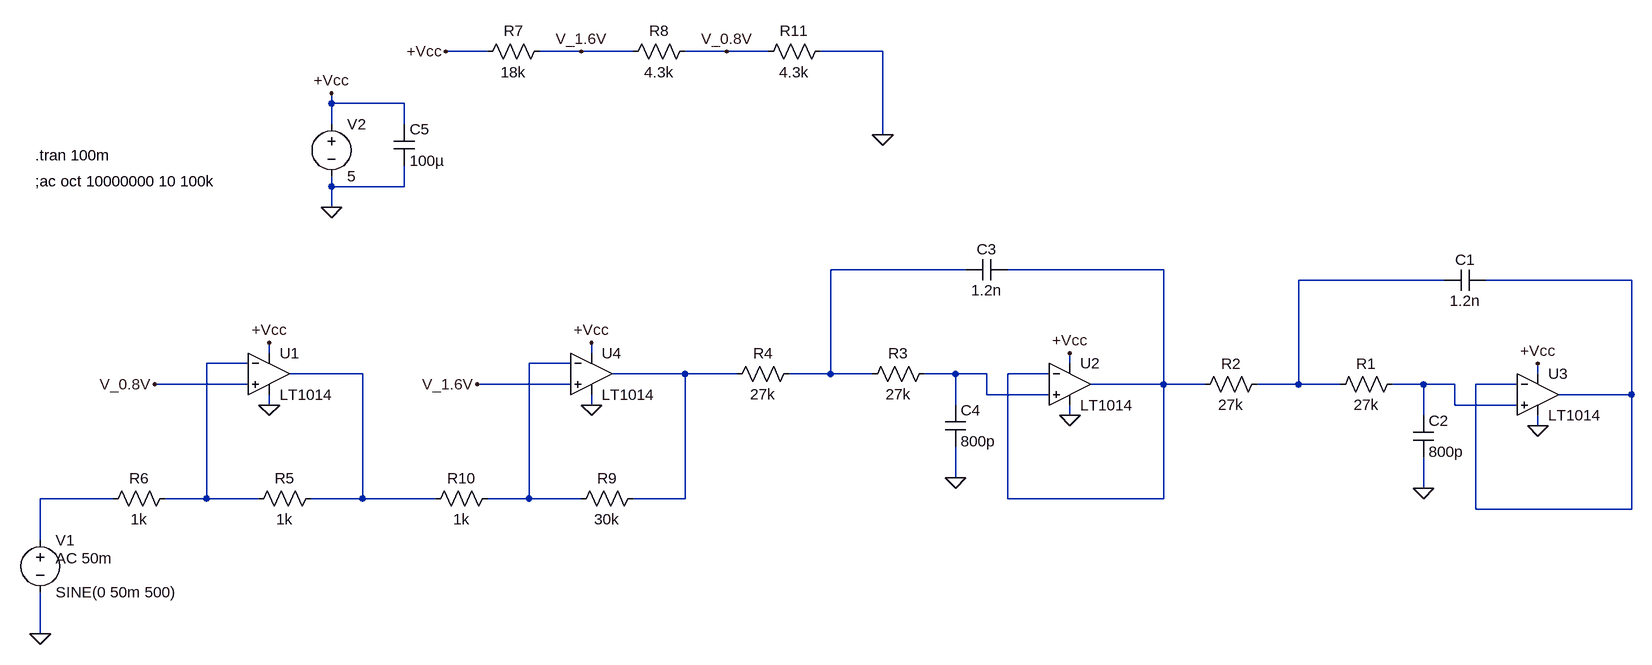
[diagram p0: schematic Lab_PCB.asc]
Lab_PCB.asc, the LTspice schematic file:
Version 4
SHEET 1 2728 680
WIRE 128 -864 64 -864
WIRE 272 -864 208 -864
WIRE 352 -864 272 -864
WIRE 496 -864 432 -864
WIRE 560 -864 496 -864
WIRE 736 -864 640 -864
WIRE -112 -784 -112 -800
WIRE 0 -784 -112 -784
WIRE -112 -752 -112 -784
WIRE 0 -752 0 -784
WIRE 736 -736 736 -864
WIRE -112 -656 -112 -672
WIRE 0 -656 0 -688
WIRE 0 -656 -112 -656
WIRE -112 -624 -112 -656
WIRE 864 -528 656 -528
WIRE 1168 -528 928 -528
WIRE 1600 -512 1376 -512
WIRE 1888 -512 1664 -512
WIRE -208 -400 -208 -416
WIRE 288 -400 288 -416
WIRE -240 -384 -304 -384
WIRE 256 -384 192 -384
WIRE 1024 -384 1024 -400
WIRE -64 -368 -176 -368
WIRE 432 -368 320 -368
WIRE 512 -368 432 -368
WIRE 656 -368 656 -528
WIRE 656 -368 592 -368
WIRE 720 -368 656 -368
WIRE 848 -368 800 -368
WIRE 896 -368 848 -368
WIRE 992 -368 928 -368
WIRE 1744 -368 1744 -384
WIRE -240 -352 -384 -352
WIRE 256 -352 112 -352
WIRE 1168 -352 1168 -528
WIRE 1168 -352 1056 -352
WIRE 1232 -352 1168 -352
WIRE 1376 -352 1376 -512
WIRE 1376 -352 1312 -352
WIRE 1440 -352 1376 -352
WIRE 1568 -352 1520 -352
WIRE 1616 -352 1568 -352
WIRE 1712 -352 1648 -352
WIRE 896 -336 896 -368
WIRE 992 -336 896 -336
WIRE 1888 -336 1888 -512
WIRE 1888 -336 1776 -336
WIRE -208 -320 -208 -336
WIRE 288 -320 288 -336
WIRE 848 -320 848 -368
WIRE 1616 -320 1616 -352
WIRE 1712 -320 1616 -320
WIRE 1024 -304 1024 -320
WIRE 1568 -304 1568 -352
WIRE 1744 -288 1744 -304
WIRE 848 -208 848 -256
WIRE 1568 -192 1568 -240
WIRE -448 -176 -560 -176
WIRE -304 -176 -304 -384
WIRE -304 -176 -368 -176
WIRE -224 -176 -304 -176
WIRE -64 -176 -64 -368
WIRE -64 -176 -144 -176
WIRE 48 -176 -64 -176
WIRE 192 -176 192 -384
WIRE 192 -176 128 -176
WIRE 272 -176 192 -176
WIRE 432 -176 432 -368
WIRE 432 -176 352 -176
WIRE 928 -176 928 -368
WIRE 1168 -176 1168 -352
WIRE 1168 -176 928 -176
WIRE 1648 -160 1648 -352
WIRE 1888 -160 1888 -336
WIRE 1888 -160 1648 -160
WIRE -560 -112 -560 -176
WIRE -560 32 -560 -32
FLAG -560 32 0
FLAG 1568 -192 0
FLAG 848 -208 0
FLAG 1024 -400 +Vcc
FLAG 1744 -384 +Vcc
FLAG -208 -416 +Vcc
FLAG -112 -624 0
FLAG -112 -800 +Vcc
FLAG -208 -320 0
FLAG 1024 -304 0
FLAG 1744 -288 0
FLAG 64 -864 +Vcc
FLAG 496 -864 V_0.8V
FLAG 288 -416 +Vcc
FLAG 288 -320 0
FLAG 736 -736 0
FLAG 272 -864 V_1.6V
FLAG -384 -352 V_0.8V
FLAG 112 -352 V_1.6V
SYMBOL voltage -560 -128 R0
WINDOW 123 24 44 Left 2
WINDOW 39 0 0 Left 2
SYMATTR Value2 AC 50m
SYMATTR InstName V1
SYMATTR Value SINE(0 50m 500)
SYMBOL res 1536 -368 R90
WINDOW 0 0 56 VBottom 2
WINDOW 3 32 56 VTop 2
SYMATTR InstName R1
SYMATTR Value 27k
SYMBOL res 1328 -368 R90
WINDOW 0 0 56 VBottom 2
WINDOW 3 32 56 VTop 2
SYMATTR InstName R2
SYMATTR Value 27k
SYMBOL cap 1664 -528 R90
WINDOW 0 0 32 VBottom 2
WINDOW 3 32 32 VTop 2
SYMATTR InstName C1
SYMATTR Value 1.2n
SYMBOL cap 1552 -304 R0
SYMATTR InstName C2
SYMATTR Value 800p
SYMBOL res 816 -384 R90
WINDOW 0 0 56 VBottom 2
WINDOW 3 32 56 VTop 2
SYMATTR InstName R3
SYMATTR Value 27k
SYMBOL res 608 -384 R90
WINDOW 0 0 56 VBottom 2
WINDOW 3 32 56 VTop 2
SYMATTR InstName R4
SYMATTR Value 27k
SYMBOL cap 928 -544 R90
WINDOW 0 0 32 VBottom 2
WINDOW 3 32 32 VTop 2
SYMATTR InstName C3
SYMATTR Value 1.2n
SYMBOL cap 832 -320 R0
SYMATTR InstName C4
SYMATTR Value 800p
SYMBOL res -128 -192 R90
WINDOW 0 0 56 VBottom 2
WINDOW 3 32 56 VTop 2
SYMATTR InstName R5
SYMATTR Value 1k
SYMBOL res -352 -192 R90
WINDOW 0 0 56 VBottom 2
WINDOW 3 32 56 VTop 2
SYMATTR InstName R6
SYMATTR Value 1k
SYMBOL voltage -112 -768 R0
WINDOW 123 0 0 Left 2
WINDOW 39 0 0 Left 2
SYMATTR InstName V2
SYMATTR Value 5
SYMBOL OpAmps\\LT1014 -208 -432 R0
SYMATTR InstName U1
SYMBOL OpAmps\\LT1014 1024 -416 R0
SYMATTR InstName U2
SYMBOL OpAmps\\LT1014 1744 -400 R0
SYMATTR InstName U3
SYMBOL res 224 -880 R90
WINDOW 0 0 56 VBottom 2
WINDOW 3 32 56 VTop 2
SYMATTR InstName R7
SYMATTR Value 18k
SYMBOL res 448 -880 R90
WINDOW 0 0 56 VBottom 2
WINDOW 3 32 56 VTop 2
SYMATTR InstName R8
SYMATTR Value 4.3k
SYMBOL cap -16 -752 R0
SYMATTR InstName C5
SYMATTR Value 100µ
SYMBOL res 368 -192 R90
WINDOW 0 0 56 VBottom 2
WINDOW 3 32 56 VTop 2
SYMATTR InstName R9
SYMATTR Value 30k
SYMBOL res 144 -192 R90
WINDOW 0 0 56 VBottom 2
WINDOW 3 32 56 VTop 2
SYMATTR InstName R10
SYMATTR Value 1k
SYMBOL OpAmps\\LT1014 288 -432 R0
SYMATTR InstName U4
SYMBOL res 656 -880 R90
WINDOW 0 0 56 VBottom 2
WINDOW 3 32 56 VTop 2
SYMATTR InstName R11
SYMATTR Value 4.3k
TEXT -568 -704 Left 2 !.tran 100m
TEXT -568 -664 Left 2 !;ac oct 10000000 10 100k

The netlist it stands for:
* Lab_PCB.asc
V1 N011 0 SINE(0 50m 500) AC 50m
R1 N010 N003 27k
R2 N003 N002 27k
C1 N004 N003 1.2n
C2 N010 0 800p
R3 N009 N001 27k
R4 N001 N008 27k
C3 N002 N001 1.2n
C4 N009 0 800p
R5 N007 N005 1k
R6 N005 N011 1k
V2 +Vcc 0 5
XU1 V_0.8V N005 +Vcc 0 N007 LT1014  ; pins In+ In- V+ V- OUT
XU2 N009 N002 +Vcc 0 N002 LT1014  ; pins In+ In- V+ V- OUT
XU3 N010 N004 +Vcc 0 N004 LT1014  ; pins In+ In- V+ V- OUT
R7 V_1.6V +Vcc 18k
R8 V_0.8V V_1.6V 4.3k
C5 +Vcc 0 100µ
R9 N008 N006 30k
R10 N006 N007 1k
XU4 V_1.6V N006 +Vcc 0 N008 LT1014  ; pins In+ In- V+ V- OUT
R11 0 V_0.8V 4.3k
.tran 100m
;ac oct 10000000 10 100k
.backanno
.end